# Altium project ESP32_LoRa_Master_Project.PrjPcb
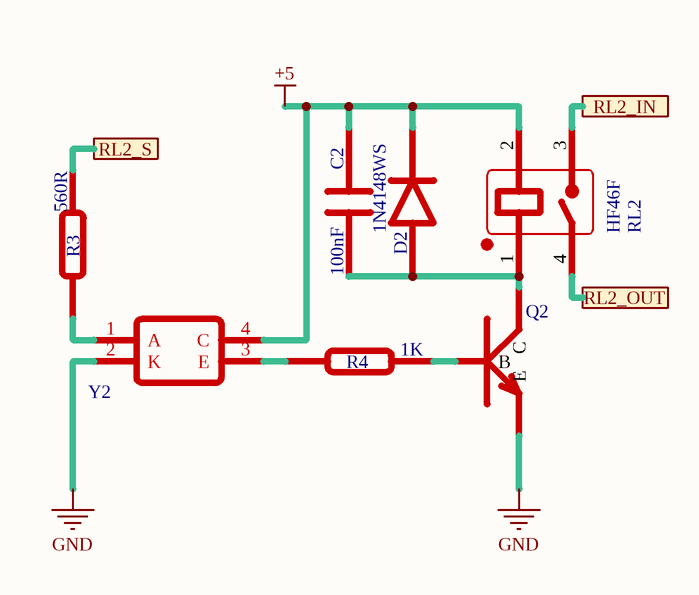
[diagram p0: Relay2_Block.SchDoc]
Company: HTD-Co.limit; Design By: CT-ENERGY; Version: V3
8 sheets, 55 parts. Net scope: flat (ports and power ports of the same name join across sheets).
Board file: PCB2.PcbDoc
Sheets:
  Relay2_Block.SchDoc
  Relay3_Block.SchDoc
  RF_Block.SchDoc
  3V3_Block.SchDoc
  Fan_Block.SchDoc
  Relay_Connector_Block.SchDoc
  MCU.SchDoc
  Relay4_Block.SchDoc

## Sheet Relay2_Block.SchDoc
size A4; CheckedBy: CT-Energys; Author: CT-Energys; CompanyName: HTD COMPANY LIMITED; DrawnBy: CHITOAN; Engineer: CHITOAN; Organization: Altium Limited; Address1: HO CHI MINH CITY; Address2: VIETNAM

### Parts
C2  100nF  [C0805]
D2  1N4148WS  [SMA]
Q2  S8050  [SOT-23]  (value not drawn)
R3  560R  [R0603]
R4  1K  [R0603]
RL2  HF46F  [HF-46-X]
Y2  PHOTOCOUPLER  [SOP-4]  (value not drawn)

### Ports
RL2_IN, RL2_OUT, RL2_S

### Nets
+5: C2.2 D2.K RL2.2 Y2.4(C)
GND: Q2.2(E) Y2.2(K)
NetC2_1: C2.1 D2.A Q2.3(C) RL2.1
NetH8_1: RL2.3 ; port RL2_IN
NetH8_2: RL2.4 ; port RL2_OUT
NetQ2_1: Q2.1(B) R4.1
NetR3_1: R3.1 ; port RL2_S
NetR3_2: R3.2 Y2.1(A)
NetR4_2: R4.2 Y2.3(E)

### Notes on the sheet
- Title
- Size:
- Date:
- A4
- Number:
- Time:
- Revision:
- Design by:
- Company:
- File:

### Library data of the parts
C2 = CAP-CER: Ceramic Capacitor
D2 = 1N4148WS: Small Signal Diode
Q2 = S8050: NPN Transistors 0.5A Collector to Emitter 25V
R3 R4 = Resistor
RL2 = HF46F: Relay 4 Pin; ComponentLink1Description: HF-46F; ComponentLink1URL: https://source.hongfa.com/pdf/web/viewer.html?file=/Uploads/Product/PDF/HF46F_en.pdf
Y2 = PC817: Photo-Coupler; ComponentLink1Description: PC817; ComponentLink1URL: https://www.socle-tech.com/doc/IC%20Channel%20Product/Optoelectronic%20Components/Photocoupler/PC8171_NIP1B_ED-16P023.pdf

## Sheet Relay3_Block.SchDoc
size A4; CheckedBy: CT-Energys; Author: CT-Energys; CompanyName: HTD COMPANY LIMITED; DrawnBy: CHITOAN; Engineer: CHITOAN; Organization: Altium Limited; Address1: HO CHI MINH CITY; Address2: VIETNAM
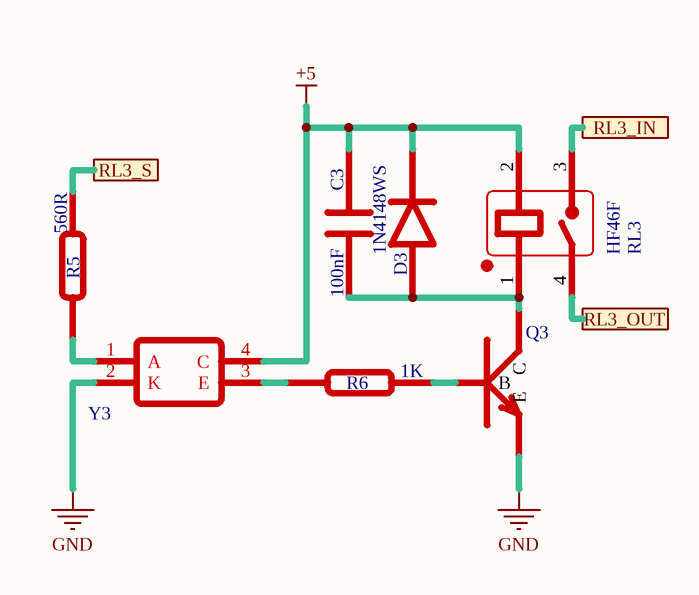
[diagram p1: Relay3_Block.SchDoc]

### Parts
C3  100nF  [C0805]
D3  1N4148WS  [SMA]
Q3  S8050  [SOT-23]  (value not drawn)
R5  560R  [R0603]
R6  1K  [R0603]
RL3  HF46F  [HF-46-X]
Y3  PHOTOCOUPLER  [SOP-4]  (value not drawn)

### Ports
RL3_IN, RL3_OUT, RL3_S

### Nets
+5: C3.2 D3.K RL3.2 Y3.4(C)
GND: Q3.2(E) Y3.2(K)
NetC3_1: C3.1 D3.A Q3.3(C) RL3.1
NetH9_1: RL3.3 ; port RL3_IN
NetH9_2: RL3.4 ; port RL3_OUT
NetQ3_1: Q3.1(B) R6.1
NetR5_1: R5.1 ; port RL3_S
NetR5_2: R5.2 Y3.1(A)
NetR6_2: R6.2 Y3.3(E)

### Notes on the sheet
- Title
- Size:
- Date:
- A4
- Number:
- Time:
- Revision:
- Design by:
- Company:
- File:

### Library data of the parts
C3 = CAP-CER: Ceramic Capacitor
D3 = 1N4148WS: Small Signal Diode
Q3 = S8050: as Q2 on sheet Relay2_Block
R5 R6 = Resistor
RL3 = HF46F: Relay 4 Pin; ComponentLink1Description: HF-46F; ComponentLink1URL: https://source.hongfa.com/pdf/web/viewer.html?file=/Uploads/Product/PDF/HF46F_en.pdf
Y3 = PC817: Photo-Coupler; ComponentLink1Description: PC817; ComponentLink1URL: https://www.socle-tech.com/doc/IC%20Channel%20Product/Optoelectronic%20Components/Photocoupler/PC8171_NIP1B_ED-16P023.pdf

## Sheet RF_Block.SchDoc
size A4; CheckedBy: CT-Energys; Author: CT-Energys; CompanyName: HTD COMPANY LIMITED; DrawnBy: CHITOAN; Engineer: CHITOAN; Organization: Altium Limited; Address1: HO CHI MINH CITY; Address2: VIETNAM
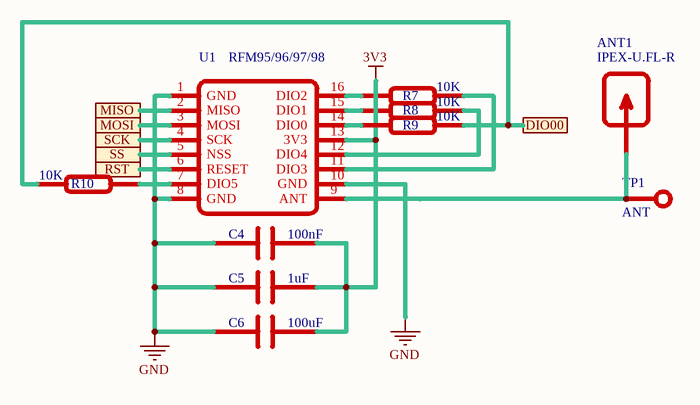
[diagram p2: RF_Block.SchDoc]

### Parts
ANT1  IPEX-U.FL-R  [IPEX Connector SMD]
C4  100nF  [C0805]
C5  1uF  [C0805]
C6  100uF  [C0805]
R7  10K  [R0805]
R8  10K  [R0805]
R9  10K  [R0603]
R10  10K  [R0603]
TP1  ANT  [Test Point]
U1  RFM95/96/97/98  [LORA RFM95/96/97/98W]

### Ports
DIO00, MISO, MOSI, RST, SCK, SS

### Nets
3V3: C4.2 C5.2 C6.2 U1.13(3V3)
GND: C4.1 C5.1 C6.1 U1.1(GND) U1.8(GND) U1.10(GND)
NetANT1_1: ANT1.1 TP1.1 U1.9(ANT)
NetR7_1: R7.1 U1.16(DIO2)
NetR7_2: R7.2 U1.11(DIO3)
NetR8_1: R8.1 U1.15(DIO1)
NetR8_2: R8.2 U1.12(DIO4)
NetR9_1: R9.1 U1.14(DIO0)
NetR9_2: R9.2 R10.1 ; port DIO00
NetR10_2: R10.2 U1.7(DIO5)
NetU1_2: U1.2(MISO) ; port MISO
NetU1_3: U1.3(MOSI) ; port MOSI
NetU1_4: U1.4(SCK) ; port SCK
NetU1_5: U1.5(NSS) ; port SS
NetU1_6: U1.6(RESET) ; port RST

Not connected (* = marked no-connect by the designer): ANT1 2(GND)

### Notes on the sheet
- Title
- Size:
- Date:
- A4
- Number:
- Time:
- Revision:
- Design by:
- Company:
- File:

### Library data of the parts
ANT1 = IPEX-U.FL-R: RF Antena; ComponentLink1Description: Datasheets; ComponentLink1URL: https://cdn.taoglas.com/datasheets/RECE.20279.001E.01.pdf
C4-C6 = CAP-CER: Ceramic Capacitor
R7-R10 = Resistor
TP1 = TestPoint: Test Point
U1 = RFM95/96/97/98 LORA Module: The RFM95/96/97/98(W) transceivers feature the LoRaTM    long range modem that provides ultra-long range spread spectrum communication and high interference immunity whilst minimising current consumption.; ComponentLink1Description: RFM95/96/97/98; ComponentLink1URL: https://cdn.sparkfun.com/assets/learn_tutorials/8/0/4/RFM95_96_97_98W.pdf

## Sheet 3V3_Block.SchDoc
size A4; SheetNumber: 6; SheetTotal: 18
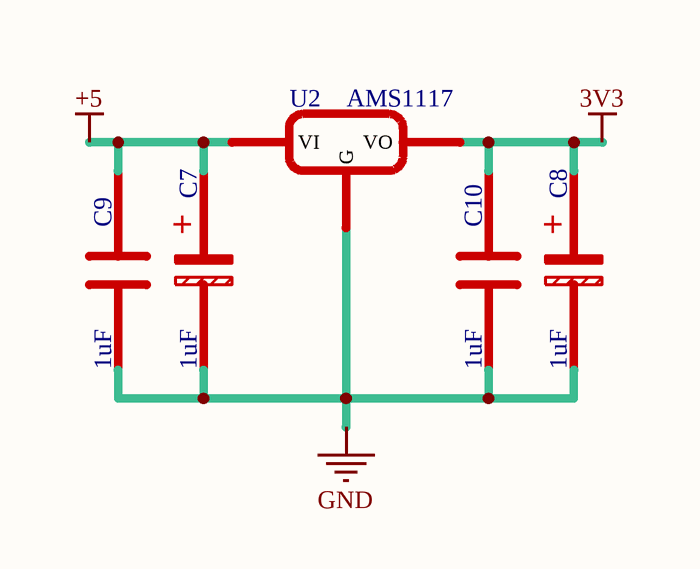
[diagram p3: 3V3_Block.SchDoc]

### Parts
C7  1uF  [CAP-AL-4x5.4]
C8  1uF  [CAP-AL-4x5.4]
C9  1uF  [C0805]
C10  1uF  [C0805]
U2  AMS1117  [SOT-223]

### Nets
3V3: C8.1 C10.2 U2.2(VO)
+5: C7.1 C9.2 U2.3(VI)
GND: C7.2 C8.2 C9.1 C10.1 U2.1(G)

### Notes on the sheet
- (in symbol CAP-ALU) +

### Library data of the parts
C7 C8 = CAP-ALU: Aluminum Capacitor
C9 C10 = CAP-CER: Ceramic Capacitor
U2 = AMS1117: Regulator intergated chip; pin to pad: 4>2; ComponentLink1Description: AMS1117-3.3; ComponentLink1URL: https://mm.digikey.com/Volume0/opasdata/d220001/medias/docus/6283/AMS1117-2.5.pdf

## Sheet Fan_Block.SchDoc
size A4; CheckedBy: CT-Energys; Author: CT-Energys; CompanyName: HTD COMPANY LIMITED; DrawnBy: CHITOAN; Engineer: CHITOAN; Organization: Altium Limited; Address1: HO CHI MINH CITY; Address2: VIETNAM
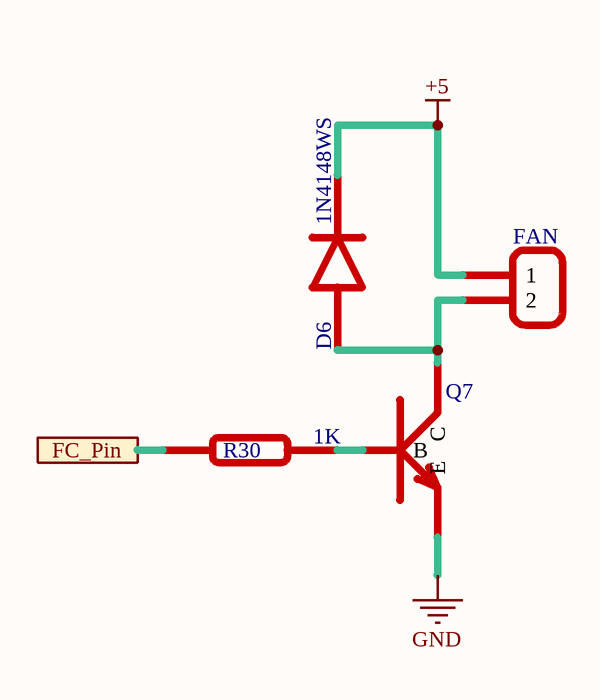
[diagram p4: Fan_Block.SchDoc]

### Parts
D6  1N4148WS  [SMA]
H4  FAN  [XH-2.54-2P]
Q7  S8050  [SOT-23]  (value not drawn)
R30  1K  [R0603]

### Ports
FC_Pin

### Nets
+5: D6.K H4.1
GND: Q7.2(E)
NetD6_A: D6.A H4.2 Q7.3(C)
NetQ7_1: Q7.1(B) R30.2
NetR30_1: R30.1 ; port FC_Pin

### Notes on the sheet
- Title
- Size:
- Date:
- A4
- Number:
- Time:
- Revision:
- Design by:
- Company:
- File:

### Library data of the parts
D6 = 1N4148WS: Small Signal Diode
H4 = CONN-2P: Connector 2 Pole
Q7 = S8050: as Q2 on sheet Relay2_Block
R30 = Resistor

## Sheet Relay_Connector_Block.SchDoc
size A4; CheckedBy: CT-Energys; Author: CT-Energys; CompanyName: HTD COMPANY LIMITED; DrawnBy: CHITOAN; Engineer: CHITOAN; Organization: Altium Limited; Address1: HO CHI MINH CITY; Address2: VIETNAM
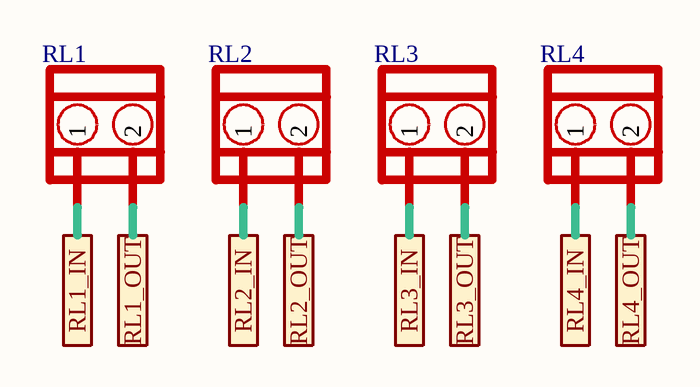
[diagram p5: Relay_Connector_Block.SchDoc]

### Parts
H7  RL1  [KF301-2-V]
H8  RL2  [KF301-2-V]
H9  RL3  [KF301-2-V]
H10  RL4  [KF301-2-V]

### Ports
RL1_IN, RL1_OUT, RL2_IN, RL2_OUT, RL3_IN, RL3_OUT, RL4_IN, RL4_OUT

### Nets
NetH7_1: H7.1 ; port RL1_IN
NetH7_2: H7.2 ; port RL1_OUT
NetH8_1: H8.1 ; port RL2_IN
NetH8_2: H8.2 ; port RL2_OUT
NetH9_1: H9.1 ; port RL3_IN
NetH9_2: H9.2 ; port RL3_OUT
NetH10_1: H10.1 ; port RL4_IN
NetH10_2: H10.2 ; port RL4_OUT

### Notes on the sheet
- Title
- Size:
- Date:
- A4
- Number:
- Time:
- Revision:
- Design by:
- Company:
- File:

### Library data of the parts
H7-H10 = KF301-2-V: Connector 5.08MM Pitch Vertical 2 Pole

## Sheet MCU.SchDoc
size A4; CheckedBy: CT-Energys; Author: CT-Energys; CompanyName: HTD COMPANY LIMITED; DrawnBy: CHITOAN; Engineer: CHITOAN; Organization: Altium Limited; Address1: HO CHI MINH CITY; Address2: VIETNAM
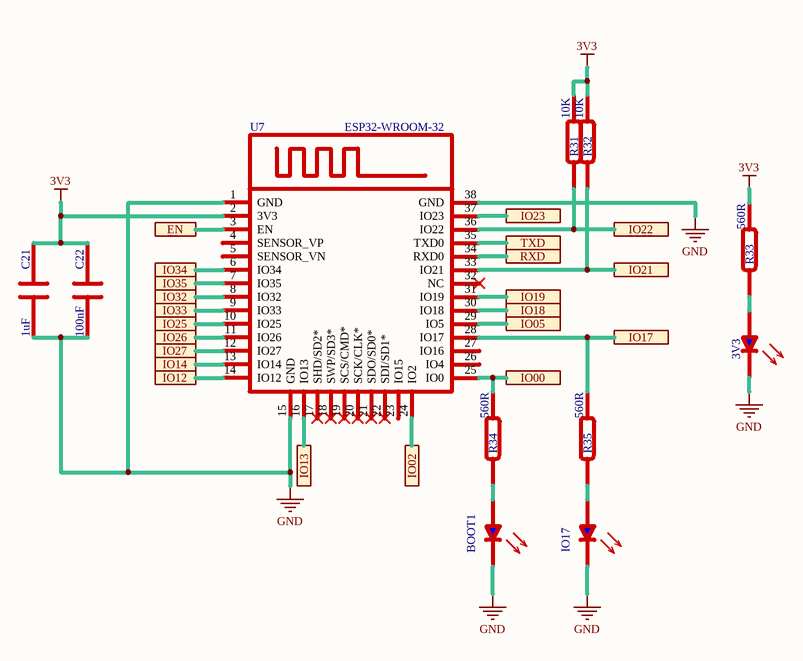
[diagram p6: MCU.SchDoc]

### Parts
BOOT1  LED-BLUE  [LED-0603-BLUE]  (value not drawn)
C21  1uF  [C0603]
C22  100nF  [C0603]
IO1  IO17  [LED-0603-BLUE]
L3  3V3  [LED-0603-BLUE]
R31  10K  [R0603]
R32  10K  [R0603]
R33  560R  [R0603]
R34  560R  [R0603]
R35  560R  [R0603]
U7  ESP32-WROOM-32  [ESP32-WROOM-32]

### Ports
EN, IO00, IO02, IO05, IO12, IO13, IO14, IO17, IO18, IO19, IO21, IO22, IO23, IO25, IO26, IO27, IO32, IO33, IO34, IO35, RXD, TXD

### Nets
3V3: C21.2 C22.2 R31.1 R32.1 R33.1 U7.2(3V3)
GND: BOOT1.2(K) C21.1 C22.1 IO1.2(K) L3.2(K) U7.1(GND) U7.15(GND) U7.38(GND)
NetBOOT1_1: BOOT1.1(A) R34.2
NetIO1_1: IO1.1(A) R35.2
NetL3_1: L3.1(A) R33.2
NetR31_2: R31.2 U7.36(IO22) ; port IO22
NetR32_2: R32.2 U7.33(IO21) ; port IO21
NetR34_1: R34.1 U7.25(IO0) ; port IO00
NetR35_1: R35.1 U7.28(IO17) ; port IO17
NetU7_3: U7.3(EN) ; port EN
NetU7_6: U7.6(IO34) ; port IO34
NetU7_7: U7.7(IO35) ; port IO35
NetU7_8: U7.8(IO32) ; port IO32
NetU7_9: U7.9(IO33) ; port IO33
NetU7_10: U7.10(IO25) ; port IO25
NetU7_11: U7.11(IO26) ; port IO26
NetU7_12: U7.12(IO27) ; port IO27
NetU7_13: U7.13(IO14) ; port IO14
NetU7_14: U7.14(IO12) ; port IO12
NetU7_16: U7.16(IO13) ; port IO13
NetU7_24: U7.24(IO2) ; port IO02
NetU7_29: U7.29(IO5) ; port IO05
NetU7_30: U7.30(IO18) ; port IO18
NetU7_31: U7.31(IO19) ; port IO19
NetU7_34: U7.34(RXD0) ; port RXD
NetU7_35: U7.35(TXD0) ; port TXD
NetU7_37: U7.37(IO23) ; port IO23

Not connected (* = marked no-connect by the designer): U7 4(SENSOR_VP) 5(SENSOR_VN) 17(SHD/SD2*)* 18(SWP/SD3*)* 19(SCS/CMD*)* 20(SCK/CLK*)* 21(SDO/SD0*)* 22(SDI/SD1*)* 23(IO15) 26(IO4) 27(IO16) 32(NC)* 39(GND)

### Notes on the sheet
- Title
- Size:
- Date:
- A4
- Number:
- Time:
- Revision:
- Design by:
- Company:
- File:

### Library data of the parts
BOOT1 IO1 L3 = LED-Blue: Blue Light Emiter Diode
C21 C22 = CAP-CER: Ceramic Capacitor
R31-R35 = Resistor
U7 = ESP32-WROOM-32: ESP32 powerfull micro controller CHIP; ComponentLink1Description: ESP32-WROOM-32E-N4; ComponentLink1URL: https://www.espressif.com/sites/default/files/documentation/esp32-wroom-32e_esp32-wroom-32ue_datasheet_en.pdf

## Sheet Relay4_Block.SchDoc
size A4; CheckedBy: CT-Energys; Author: CT-Energys; CompanyName: HTD COMPANY LIMITED; DrawnBy: CHITOAN; Engineer: CHITOAN; Organization: Altium Limited; Address1: HO CHI MINH CITY; Address2: VIETNAM
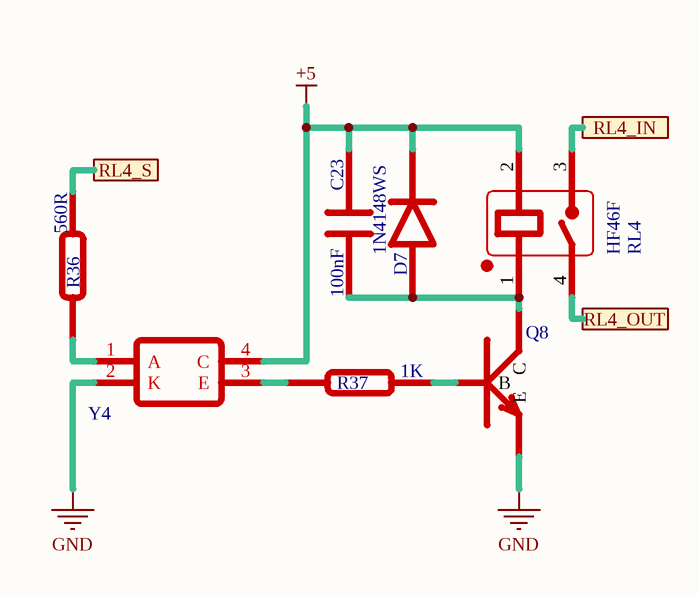
[diagram p7: Relay4_Block.SchDoc]

### Parts
C23  100nF  [C0805]
D7  1N4148WS  [SMA]
Q8  S8050  [SOT-23]  (value not drawn)
R36  560R  [R0603]
R37  1K  [R0603]
RL4  HF46F  [HF-46-X]
Y4  PHOTOCOUPLER  [SOP-4]  (value not drawn)

### Ports
RL4_IN, RL4_OUT, RL4_S

### Nets
+5: C23.2 D7.K RL4.2 Y4.4(C)
GND: Q8.2(E) Y4.2(K)
NetC23_1: C23.1 D7.A Q8.3(C) RL4.1
NetH10_1: RL4.3 ; port RL4_IN
NetH10_2: RL4.4 ; port RL4_OUT
NetQ8_1: Q8.1(B) R37.1
NetR36_1: R36.1 ; port RL4_S
NetR36_2: R36.2 Y4.1(A)
NetR37_2: R37.2 Y4.3(E)

### Notes on the sheet
- Title
- Size:
- Date:
- A4
- Number:
- Time:
- Revision:
- Design by:
- Company:
- File:

### Library data of the parts
C23 = CAP-CER: Ceramic Capacitor
D7 = 1N4148WS: Small Signal Diode
Q8 = S8050: as Q2 on sheet Relay2_Block
R36 R37 = Resistor
RL4 = HF46F: Relay 4 Pin; ComponentLink1Description: HF-46F; ComponentLink1URL: https://source.hongfa.com/pdf/web/viewer.html?file=/Uploads/Product/PDF/HF46F_en.pdf
Y4 = PC817: Photo-Coupler; ComponentLink1Description: PC817; ComponentLink1URL: https://www.socle-tech.com/doc/IC%20Channel%20Product/Optoelectronic%20Components/Photocoupler/PC8171_NIP1B_ED-16P023.pdf

## Nets that join several sheets
3V3: RF_Block (C4.2 C5.2 C6.2 U1.13), 3V3_Block (C8.1 C10.2 U2.2), MCU (6 pins)
+5: Relay2_Block (C2.2 D2.K RL2.2 Y2.4), Relay3_Block (C3.2 D3.K RL3.2 Y3.4), 3V3_Block (C7.1 C9.2 U2.3), Fan_Block (D6.K H4.1), Relay4_Block (C23.2 D7.K RL4.2 Y4.4)
GND: Relay2_Block (Q2.2 Y2.2), Relay3_Block (Q3.2 Y3.2), RF_Block (6 pins), 3V3_Block (5 pins), Fan_Block (Q7.2), MCU (8 pins), Relay4_Block (Q8.2 Y4.2)
NetH8_1: Relay2_Block (RL2.3), Relay_Connector_Block (H8.1)
NetH8_2: Relay2_Block (RL2.4), Relay_Connector_Block (H8.2)
NetH9_1: Relay3_Block (RL3.3), Relay_Connector_Block (H9.1)
NetH9_2: Relay3_Block (RL3.4), Relay_Connector_Block (H9.2)
NetH10_1: Relay_Connector_Block (H10.1), Relay4_Block (RL4.3)
NetH10_2: Relay_Connector_Block (H10.2), Relay4_Block (RL4.4)